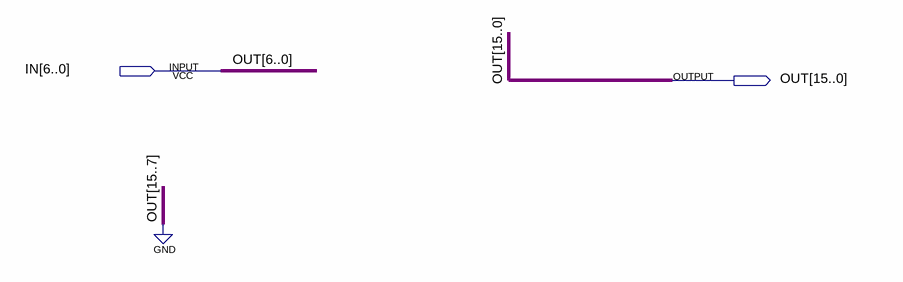
[diagram p0: schematic sheet]
// Quartus schematic SIGNEXTEND.bdf as structural Verilog: 0 symbols, 2 pins
module SIGNEXTEND (
  input  [6:0] IN,
  output [15:0] OUT
);


  assign OUT = {{9{1'b0}}, IN};
endmodule
